# EAGLE schematic source_eagle (EAGLE 9.6.2)
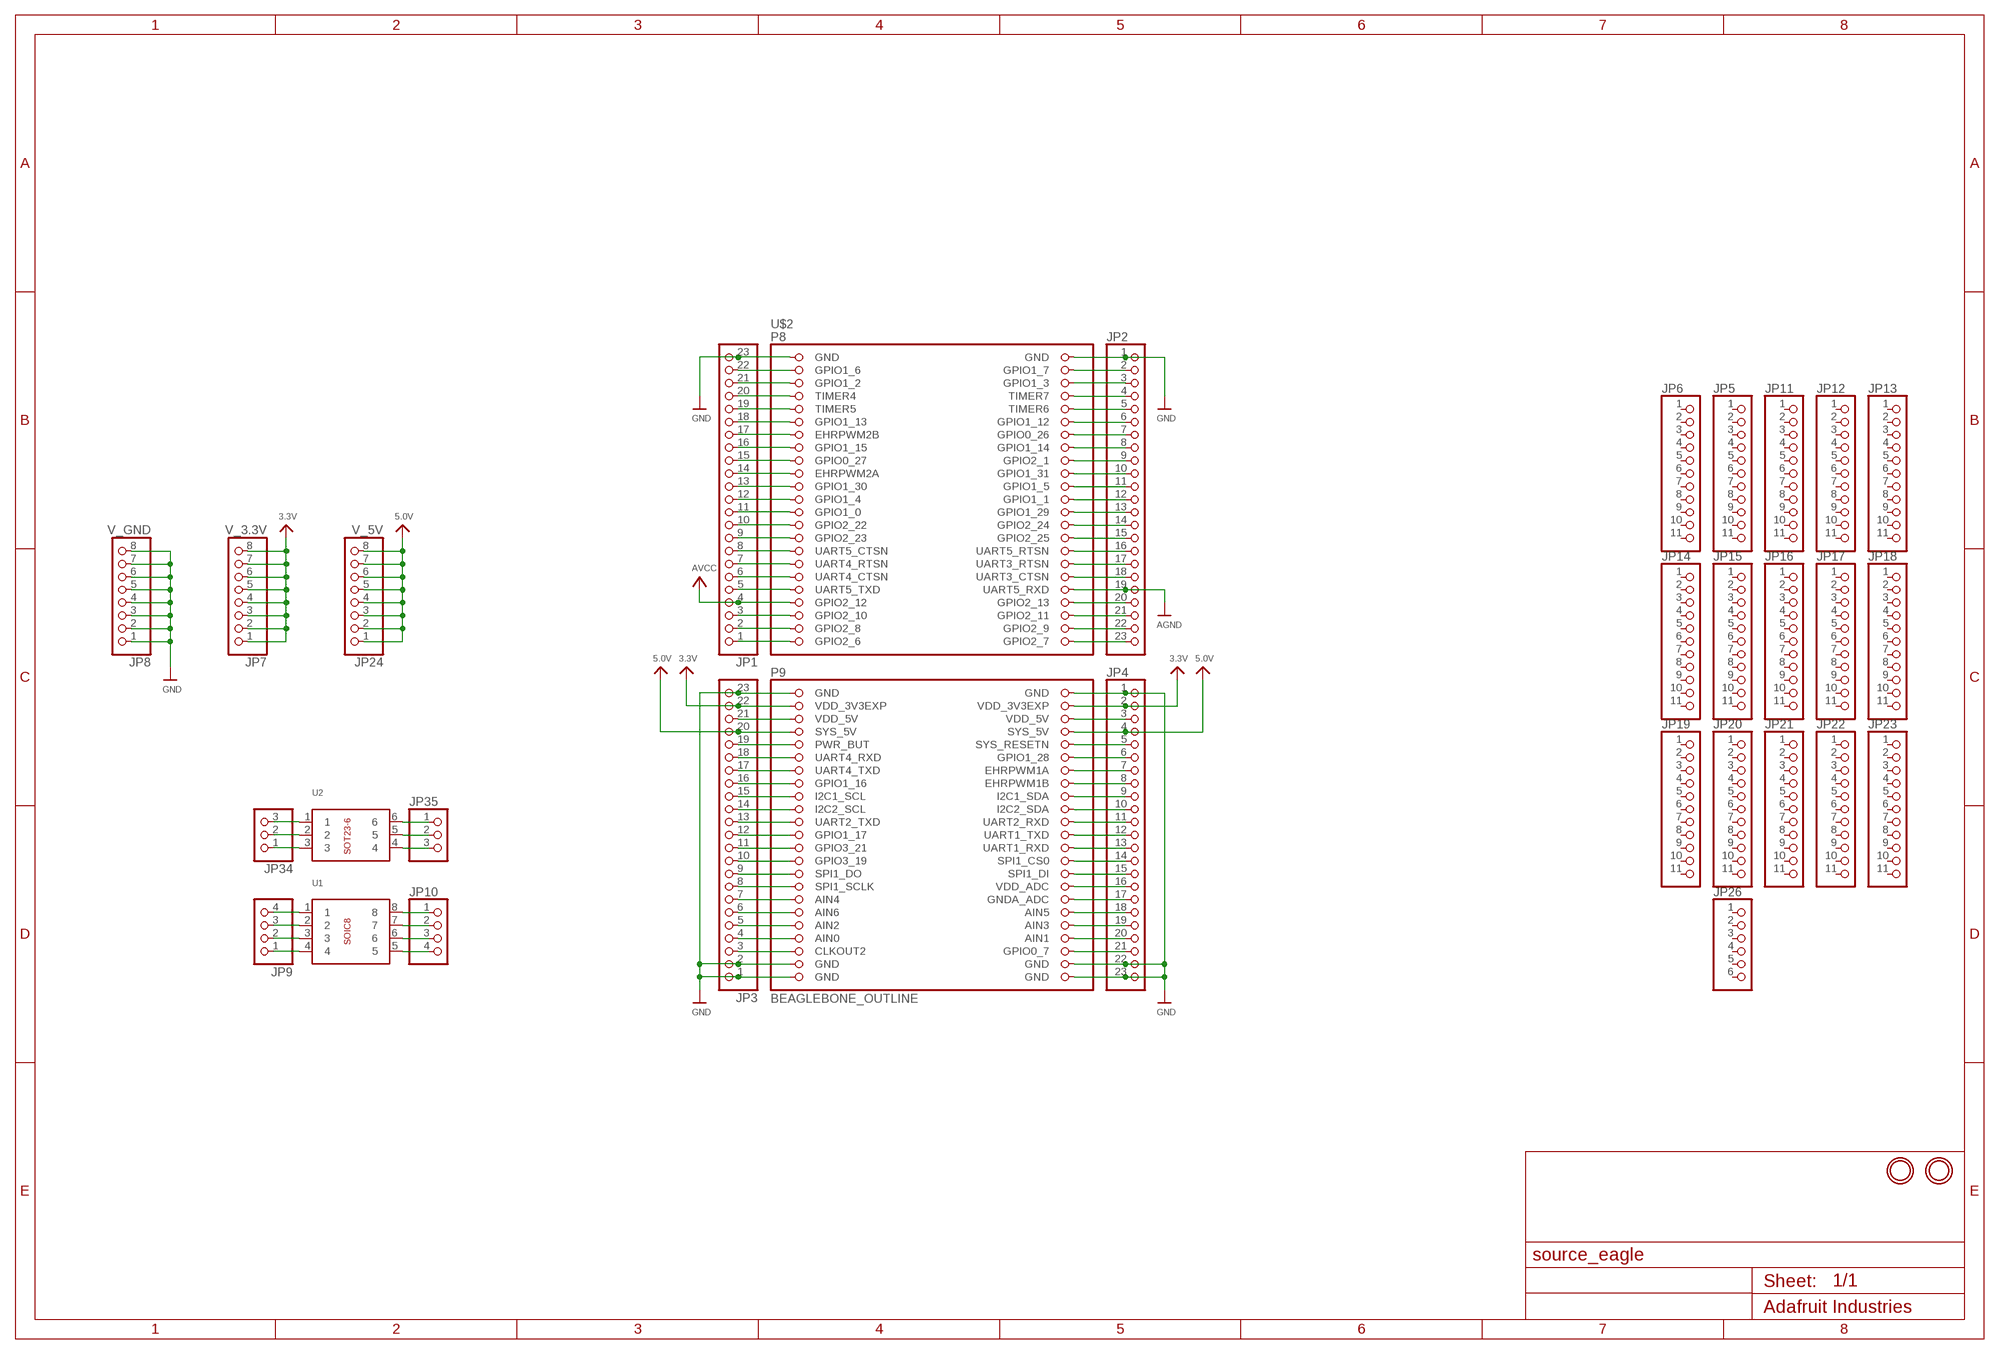
[diagram p0: schematic, sheet 1]

## Parts
JP1  HEADER-1X23  [1X23_ROUND_70MIL]
JP2  HEADER-1X23  [1X23_ROUND_70MIL]
JP3  HEADER-1X23  [1X23_ROUND_70MIL]
JP4  HEADER-1X23  [1X23_ROUND_70MIL]
JP5  HEADER-1X1176MIL  [1X11_ROUND_76]
JP6  HEADER-1X1176MIL  [1X11_ROUND_76]
JP7  V_3.3V  HEADER-1X870MIL  [1X08_ROUND_70]
JP8  V_GND  HEADER-1X870MIL  [1X08_ROUND_70]
JP9  HEADER-1X476MIL  [1X04_ROUND_76]
JP10  HEADER-1X476MIL  [1X04_ROUND_76]
JP11  HEADER-1X1176MIL  [1X11_ROUND_76]
JP12  HEADER-1X1176MIL  [1X11_ROUND_76]
JP13  HEADER-1X1176MIL  [1X11_ROUND_76]
JP14  HEADER-1X1176MIL  [1X11_ROUND_76]
JP15  HEADER-1X1176MIL  [1X11_ROUND_76]
JP16  HEADER-1X1176MIL  [1X11_ROUND_76]
JP17  HEADER-1X1176MIL  [1X11_ROUND_76]
JP18  HEADER-1X1176MIL  [1X11_ROUND_76]
JP19  HEADER-1X1176MIL  [1X11_ROUND_76]
JP20  HEADER-1X1176MIL  [1X11_ROUND_76]
JP21  HEADER-1X1176MIL  [1X11_ROUND_76]
JP22  HEADER-1X1176MIL  [1X11_ROUND_76]
JP23  HEADER-1X1176MIL  [1X11_ROUND_76]
JP24  V_5V  HEADER-1X870MIL  [1X08_ROUND_70]
JP26  HEADER-1X676MIL  [1X06_ROUND_76]
JP34  HEADER-1X376MIL  [1X03_ROUND_76]
JP35  HEADER-1X376MIL  [1X03_ROUND_76]
U1  BREAKOUT_SOIC8  [BREAKOUT_SOIC8]
U2  BREAKOUT_SOT23-6  [BREAKOUT_SOT23-6]
U$2  BEAGLEBONE_OUTLINE  [BEAGLEBONE_SHIELD]
U$22  MOUNTINGHOLE3.0THIN  [MOUNTINGHOLE_3.0_PLATEDTHIN]
U$23  MOUNTINGHOLE3.0THIN  [MOUNTINGHOLE_3.0_PLATEDTHIN]

## Nets
3.3V: JP3.22 JP4.2 JP7.1 JP7.2 JP7.3 JP7.4 JP7.5 JP7.6 JP7.7 JP7.8 U$2.49(VDD_3V3EXP) U$2.50(VDD_3V3EXP)
5.0V: JP3.20 JP4.4 JP24.1 JP24.2 JP24.3 JP24.4 JP24.5 JP24.6 JP24.7 JP24.8 U$2.53(SYS_5V) U$2.54(SYS_5V)
AGND: JP2.19 U$2.38(UART5_RXD)
AVCC: JP1.4 U$2.39(GPIO2_12)
GND: JP1.23 JP2.1 JP3.1 JP3.2 JP3.23 JP4.1 JP4.22 JP4.23 JP8.1 JP8.2 JP8.3 JP8.4 JP8.5 JP8.6 JP8.7 JP8.8 U$2.1(GND) U$2.2(GND) U$2.47(GND) U$2.48(GND) U$2.89(GND) U$2.90(GND) U$2.91(GND) U$2.92(GND)
N$1: JP9.4 U1.1
N$2: JP9.3 U1.2
N$3: JP9.2 U1.3
N$4: JP1.20 U$2.7(TIMER4)
N$5: JP1.19 U$2.9(TIMER5)
N$6: JP1.18 U$2.11(GPIO1_13)
N$7: JP1.17 U$2.13(EHRPWM2B)
N$8: JP1.16 U$2.15(GPIO1_15)
N$9: JP1.15 U$2.17(GPIO0_27)
N$10: JP1.14 U$2.19(EHRPWM2A)
N$11: JP1.13 U$2.21(GPIO1_30)
N$12: JP1.12 U$2.23(GPIO1_4)
N$13: JP1.11 U$2.25(GPIO1_0)
N$14: JP1.10 U$2.27(GPIO2_22)
N$15: JP1.9 U$2.29(GPIO2_23)
N$16: JP1.8 U$2.31(UART5_CTSN)
N$17: JP1.7 U$2.33(UART4_RTSN)
N$18: JP1.6 U$2.35(UART4_CTSN)
N$19: JP1.5 U$2.37(UART5_TXD)
N$20: JP9.1 U1.4
N$21: JP1.3 U$2.41(GPIO2_10)
N$22: JP1.2 U$2.43(GPIO2_8)
N$23: JP1.1 U$2.45(GPIO2_6)
N$24: JP10.1 U1.8
N$25: JP10.2 U1.7
N$26: JP10.3 U1.6
N$27: JP2.4 U$2.8(TIMER7)
N$28: JP2.5 U$2.10(TIMER6)
N$29: JP2.6 U$2.12(GPIO1_12)
N$30: JP2.7 U$2.14(GPIO0_26)
N$31: JP2.8 U$2.16(GPIO1_14)
N$32: JP2.9 U$2.18(GPIO2_1)
N$33: JP2.10 U$2.20(GPIO1_31)
N$34: JP2.11 U$2.22(GPIO1_5)
N$35: JP2.12 U$2.24(GPIO1_1)
N$36: JP2.13 U$2.26(GPIO1_29)
N$37: JP2.14 U$2.28(GPIO2_24)
N$38: JP2.15 U$2.30(GPIO2_25)
N$39: JP2.16 U$2.32(UART5_RTSN)
N$40: JP2.17 U$2.34(UART3_RTSN)
N$41: JP2.18 U$2.36(UART3_CTSN)
N$42: JP10.4 U1.5
N$43: JP2.20 U$2.40(GPIO2_13)
N$44: JP2.21 U$2.42(GPIO2_11)
N$45: JP2.22 U$2.44(GPIO2_9)
N$46: JP2.23 U$2.46(GPIO2_7)
N$47: JP1.22 U$2.3(GPIO1_6)
N$48: JP1.21 U$2.5(GPIO1_2)
N$49: JP3.21 U$2.51(VDD_5V)
N$50: JP2.2 U$2.4(GPIO1_7)
N$51: JP3.19 U$2.55(PWR_BUT)
N$52: JP3.18 U$2.57(UART4_RXD)
N$53: JP3.17 U$2.59(UART4_TXD)
N$54: JP3.16 U$2.61(GPIO1_16)
N$55: JP3.15 U$2.63(I2C1_SCL)
N$56: JP3.14 U$2.65(I2C2_SCL)
N$57: JP3.13 U$2.67(UART2_TXD)
N$58: JP3.12 U$2.69(GPIO1_17)
N$59: JP3.11 U$2.71(GPIO3_21)
N$60: JP3.10 U$2.73(GPIO3_19)
N$61: JP3.9 U$2.75(SPI1_DO)
N$62: JP3.8 U$2.77(SPI1_SCLK)
N$63: JP3.7 U$2.79(AIN4)
N$64: JP3.6 U$2.81(AIN6)
N$65: JP3.5 U$2.83(AIN2)
N$66: JP3.4 U$2.85(AIN0)
N$67: JP3.3 U$2.87(CLKOUT2)
N$68: JP2.3 U$2.6(GPIO1_3)
N$69: JP4.21 U$2.88(GPIO0_7)
N$72: JP4.3 U$2.52(VDD_5V)
N$74: JP4.5 U$2.56(SYS_RESETN)
N$75: JP4.6 U$2.58(GPIO1_28)
N$76: JP4.7 U$2.60(EHRPWM1A)
N$77: JP4.8 U$2.62(EHRPWM1B)
N$78: JP4.9 U$2.64(I2C1_SDA)
N$79: JP4.10 U$2.66(I2C2_SDA)
N$80: JP4.11 U$2.68(UART2_RXD)
N$81: JP4.12 U$2.70(UART1_TXD)
N$82: JP4.13 U$2.72(UART1_RXD)
N$83: JP4.14 U$2.74(SPI1_CS0)
N$84: JP4.15 U$2.76(SPI1_DI)
N$85: JP4.16 U$2.78(VDD_ADC)
N$86: JP4.17 U$2.80(GNDA_ADC)
N$87: JP4.18 U$2.82(AIN5)
N$88: JP4.19 U$2.84(AIN3)
N$89: JP4.20 U$2.86(AIN1)
N$100: JP34.3 U2.1
N$101: JP34.2 U2.2
N$102: JP34.1 U2.3
N$103: JP35.1 U2.6
N$104: JP35.2 U2.5
N$105: JP35.3 U2.4
Unconnected: JP5.1 JP5.2 JP5.3 JP5.4 JP5.5 JP5.6 JP5.7 JP5.8 JP5.9 JP5.10 JP5.11 JP6.1 JP6.2 JP6.3 JP6.4 JP6.5 JP6.6 JP6.7 JP6.8 JP6.9 JP6.10 JP6.11 JP11.1 JP11.2 JP11.3 JP11.4 JP11.5 JP11.6 JP11.7 JP11.8 JP11.9 JP11.10 JP11.11 JP12.1 JP12.2 JP12.3 JP12.4 JP12.5 JP12.6 JP12.7 JP12.8 JP12.9 JP12.10 JP12.11 JP13.1 JP13.2 JP13.3 JP13.4 JP13.5 JP13.6 JP13.7 JP13.8 JP13.9 JP13.10 JP13.11 JP14.1 JP14.2 JP14.3 JP14.4 JP14.5 JP14.6 JP14.7 JP14.8 JP14.9 JP14.10 JP14.11 JP15.1 JP15.2 JP15.3 JP15.4 JP15.5 JP15.6 JP15.7 JP15.8 JP15.9 JP15.10 JP15.11 JP16.1 JP16.2 JP16.3 JP16.4 JP16.5 JP16.6 JP16.7 JP16.8 JP16.9 JP16.10 JP16.11 JP17.1 JP17.2 JP17.3 JP17.4 JP17.5 JP17.6 JP17.7 JP17.8 JP17.9 JP17.10 JP17.11 JP18.1 JP18.2 JP18.3 JP18.4 JP18.5 JP18.6 JP18.7 JP18.8 JP18.9 JP18.10 JP18.11 JP19.1 JP19.2 JP19.3 JP19.4 JP19.5 JP19.6 JP19.7 JP19.8 JP19.9 JP19.10 JP19.11 JP20.1 JP20.2 JP20.3 JP20.4 JP20.5 JP20.6 JP20.7 JP20.8 JP20.9 JP20.10 JP20.11 JP21.1 JP21.2 JP21.3 JP21.4 JP21.5 JP21.6 JP21.7 JP21.8 JP21.9 JP21.10 JP21.11 JP22.1 JP22.2 JP22.3 JP22.4 JP22.5 JP22.6 JP22.7 JP22.8 JP22.9 JP22.10 JP22.11 JP23.1 JP23.2 JP23.3 JP23.4 JP23.5 JP23.6 JP23.7 JP23.8 JP23.9 JP23.10 JP23.11 JP26.1 JP26.2 JP26.3 JP26.4 JP26.5 JP26.6

## Library data of the parts
JP1-JP4 = microbuilder:HEADER-1X23
JP5 JP6 JP11-JP23 = microbuilder:HEADER-1X11
JP7 JP8 JP24 = microbuilder:HEADER-1X8: PIN HEADER
JP9 JP10 = microbuilder:HEADER-1X4: PIN HEADER
JP26 = microbuilder:HEADER-1X6: PIN HEADER
JP34 JP35 = microbuilder:HEADER-1X3: PIN HEADER
U1 = microbuilder:BREAKOUT_SOIC8: SOIC8 IC Breakout
U2 = microbuilder:BREAKOUT_SOT23-6: IC Breakout SOT23-6
U$2 = microbuilder:BEAGLEBONE_OUTLINE
U$22 U$23 = microbuilder:MOUNTINGHOLE: Mounting Hole